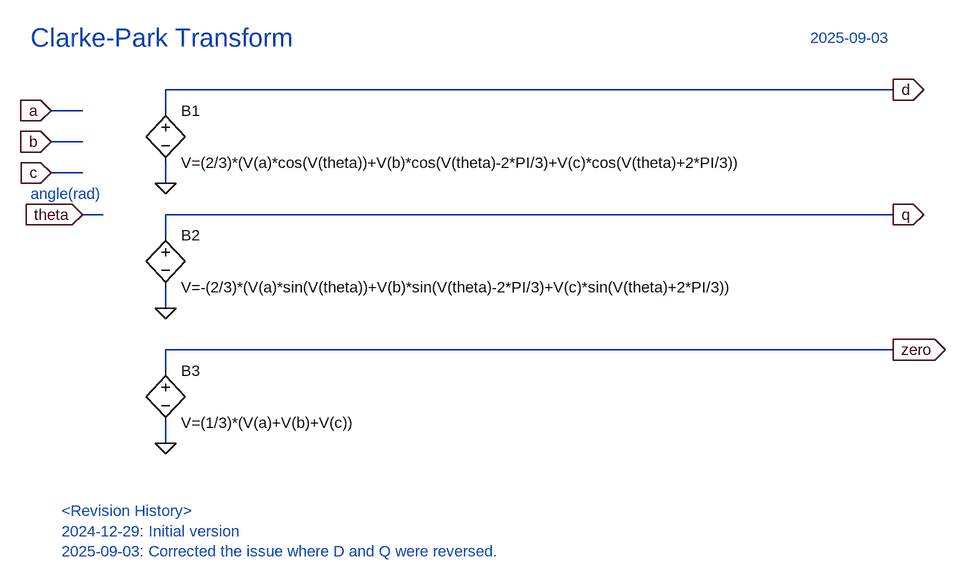
[diagram p0: schematic CLARKE_PARK.asc]
CLARKE_PARK.asc, the LTspice schematic file:
Version 4.1
SHEET 1 1500 816
WIRE 1392 96 272 96
WIRE 144 128 96 128
WIRE 272 128 272 96
WIRE 144 176 96 176
WIRE 144 224 96 224
WIRE 272 240 272 208
WIRE 176 288 144 288
WIRE 1392 288 272 288
WIRE 272 320 272 288
WIRE 272 432 272 400
WIRE 1392 496 272 496
WIRE 272 528 272 496
WIRE 272 640 272 608
FLAG 96 128 a
IOPIN 96 128 In
FLAG 96 176 b
IOPIN 96 176 In
FLAG 1392 96 d
IOPIN 1392 96 Out
FLAG 272 240 0
FLAG 96 224 c
IOPIN 96 224 In
FLAG 144 288 theta
IOPIN 144 288 In
FLAG 1392 288 q
IOPIN 1392 288 Out
FLAG 272 432 0
FLAG 1392 496 zero
IOPIN 1392 496 Out
FLAG 272 640 0
SYMBOL bv 272 112 R0
SYMATTR InstName B1
SYMATTR Value V=(2/3)*(V(a)*cos(V(theta))+V(b)*cos(V(theta)-2*PI/3)+V(c)*cos(V(theta)+2*PI/3))
SYMBOL bv 272 304 R0
SYMATTR InstName B2
SYMATTR Value V=-(2/3)*(V(a)*sin(V(theta))+V(b)*sin(V(theta)-2*PI/3)+V(c)*sin(V(theta)+2*PI/3))
SYMBOL bv 272 512 R0
SYMATTR InstName B3
SYMATTR Value V=(1/3)*(V(a)+V(b)+V(c))
TEXT 64 16 Left 4 ;Clarke-Park Transform
TEXT 1264 16 Left 2 ;2025-09-03
TEXT 64 256 Left 2 ;angle(rad)
TEXT 112 744 Left 2 ;<Revision History>\n2024-12-29: Initial version\n2025-09-03: Corrected the issue where D and Q were reversed.

The netlist it stands for:
* CLARKE_PARK.asc
B1 d 0 V=(2/3)*(V(a)*cos(V(theta))+V(b)*cos(V(theta)-2*PI/3)+V(c)*cos(V(theta)+2*PI/3))
B2 q 0 V=-(2/3)*(V(a)*sin(V(theta))+V(b)*sin(V(theta)-2*PI/3)+V(c)*sin(V(theta)+2*PI/3))
B3 zero 0 V=(1/3)*(V(a)+V(b)+V(c))
* Clarke-Park Transform
* 2025-09-03
* angle(rad)
* <Revision History>
* 2024-12-29: Initial version
* 2025-09-03: Corrected the issue where D and Q were reversed.
.backanno
.end